# Altium schematic sheet MCU-PWRA.SchDoc
size A3
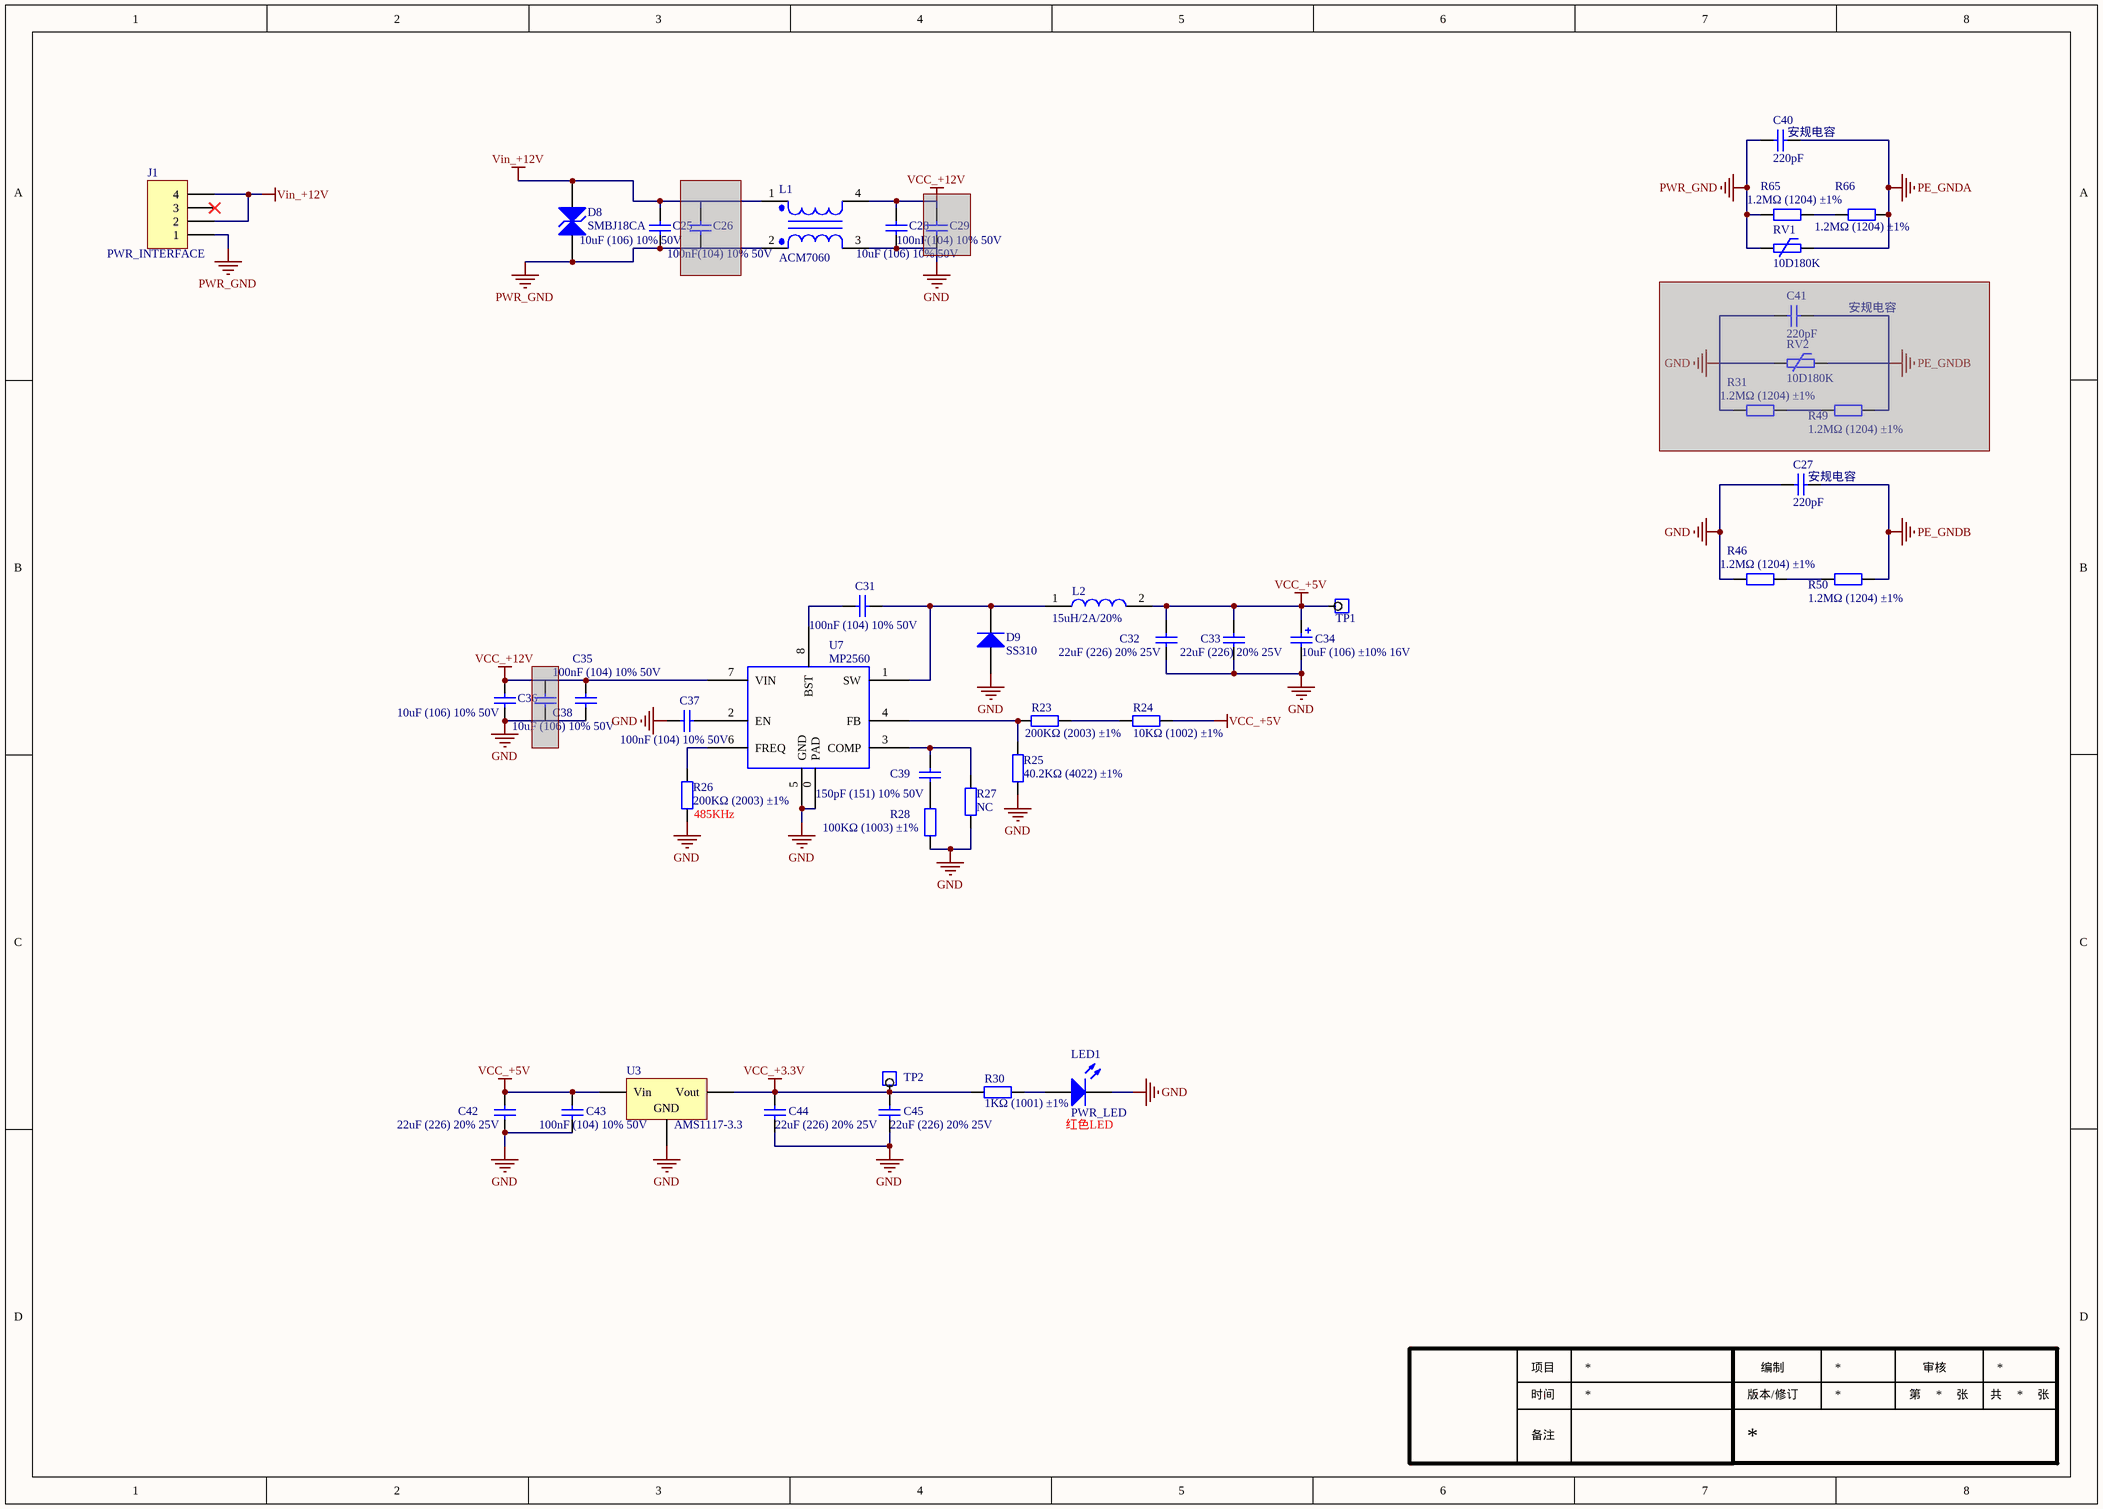
[diagram p0: MCU-PWRA.SchDoc]

## Parts
C25  10uF (106) 10% 50V  [LC-1206_C]
C26  100nF(104) 10% 50V  [LC-0805_C]  (masked out: inside a compile mask, not in the netlist)
C27  220pF  [RCC-DE1B3-ANGUI]
C28  10uF (106) 10% 50V  [LC-1206_C]
C29  100nF(104) 10% 50V  [LC-0805_C]
C31  100nF (104) 10% 50V  [LC-0603_C]
C32  22uF (226) 20% 25V  [LC-0805_C]
C33  22uF (226) 20% 25V  [LC-0805_C]
C34  10uF (106) ±10% 16V  [LC-CASE-A_3216]
C35  100nF (104) 10% 50V  [LC-0603_C]
C36  10uF (106) 10% 50V  [LC-1206_C]
C37  100nF (104) 10% 50V  [LC-0603_C]
C38  10uF (106) 10% 50V  [LC-1206_C]  (masked out: inside a compile mask, not in the netlist)
C39  150pF (151) 10% 50V  [LC-0603_C]
C40  220pF  [RCC-DE1B3-ANGUI]
C41  220pF  [RCC-DE1B3-ANGUI]  (masked out: inside a compile mask, not in the netlist)
C42  22uF (226) 20% 25V  [LC-0805_C]
C43  100nF (104) 10% 50V  [LC-0603_C]
C44  22uF (226) 20% 25V  [LC-0805_C]
C45  22uF (226) 20% 25V  [LC-0805_C]
D8  SMBJ18CA  [RCD-DO-214AAC-D]
D9  SS310  [LC-SMA(DO-214AC)_S1]
J1  PWR_INTERFACE  [RCJ3.96-4CA]
L1  ACM7060  [ACM7060]
L2  15uH/2A/20%  [RCL-040402-2TH]
LED1  PWR_LED  [LC-0603_LED_S1]
R23  200KΩ (2003) ±1%  [LC-0603_R]
R24  10KΩ (1002) ±1%  [LC-0603_R]
R25  40.2KΩ (4022) ±1%  [LC-0603_R]
R26  200KΩ (2003) ±1%  [LC-0603_R]
R27  NC  [LC-0603_R]
R28  100KΩ (1003) ±1%  [LC-0603_R]
R30  1KΩ (1001) ±1%  [LC-0603_R]
R31  1.2MΩ (1204) ±1%  [LC-1206_R]  (masked out: inside a compile mask, not in the netlist)
R46  1.2MΩ (1204) ±1%  [LC-1206_R]
R49  1.2MΩ (1204) ±1%  [LC-1206_R]  (masked out: inside a compile mask, not in the netlist)
R50  1.2MΩ (1204) ±1%  [LC-1206_R]
R65  1.2MΩ (1204) ±1%  [LC-1206_R]
R66  1.2MΩ (1204) ±1%  [LC-1206_R]
RV1  10D180K  [RCRV-10DXXXK]
RV2  10D180K  [RCRV-10DXXXK]  (masked out: inside a compile mask, not in the netlist)
TP1  Test Point  [RCTOOL-TPB]  (value not drawn)
TP2  Test Point  [RCTOOL-TPB]  (value not drawn)
U3  AMS1117-3.3  [LC-SOT-223]
U7  MP2560  [LC-SOIC-8_EP_150mil]

## Nets
GND: C27.1 C28.2 C29.2 C32.1 C33.1 C34.2 C35.1 C36.1 C37.2 C42.1 C43.1 C44.1 C45.1 D9.1(A) L1.3 LED1.K R25.1 R26.1 R27.1 R28.1 R46.1 U3.1(GND) U7.0(PAD) U7.5(GND)
PE_GNDA: C40.1 R66.2 RV1.1
PE_GNDB: C27.2 R50.2
PWR_GND: C25.2 C40.2 D8.1(A) J1.1 L1.2 R65.1 RV1.2
VCC_+3.3V: C44.2 C45.2 R30.1 TP2.1 U3.2(Vout)
VCC_+5V: C32.2 C33.2 C34.1 C42.2 C43.2 L2.2 R24.2 TP1.1 U3.3(Vin)
VCC_+12V: C35.2 C36.2 U7.7(VIN)
Vin_+12V: C25.1 D8.2(K) J1.2 J1.4 L1.1
NetC28_1: C28.1 C29.1 L1.4
NetC31_1: C31.1 D9.2(K) L2.1 U7.1(SW)
NetC31_2: C31.2 U7.8(BST)
NetC37_1: C37.1 U7.2(EN)
NetC39_1: C39.1 R28.2
NetC39_2: C39.2 R27.2 U7.3(COMP)
NetLED1_A: LED1.A R30.2
NetR23_1: R23.1 R25.2 U7.4(FB)
NetR23_2: R23.2 R24.1
NetR26_2: R26.2 U7.6(FREQ)
NetR46_2: R46.2 R50.1
NetR65_2: R65.2 R66.1

Not connected (* = marked no-connect by the designer): J1 3*

## Notes on the sheet
- (near C40) 安规电容
- 安规电容
- (near C27) 安规电容
- (near R26) 485KHz
- (near LED1) 红色LED
- 项目
- 时间
- 版本/修订
- 编制
- 第
- 审核
- 张
- 共
- 备注

## Library data of the parts
C25 C28 C36 C38 = 1206 10uF (106) 10% 50V: 贴片电容; ComponentLink1Description: 供应商链接; ComponentLink1URL: http://www.szlcsc.com/product/details_14236.html; Package: 1206; Supplier: LC; SuppliersPartNumber: C13585
C26 C29 = 0805 100nF(104) 10% 50V: 贴片电容; ComponentLink1Description: 供应商链接; ComponentLink1URL: http://www.szlcsc.com/product/details_50686.html; Package: 0805; Supplier: LC; SuppliersPartNumber: C49678
C27 C41 = Cap_Nonpolar: 无极性电容; Manufacture: Murata; Ordering: DE1B3KX221KN4AP01F; Comments: 220pF; Libnum: *
C31 C35 C37 C43 = 0603 100nF (104) 10% 50V: 贴片电容; ComponentLink1Description: 供应商链接; ComponentLink1URL: http://www.szlcsc.com/product/details_15331.html; Package: 0603; Supplier: LC; SuppliersPartNumber: C14663
C32 C33 C42 C44 C45 = 0805 22uF (226) 20% 25V: 贴片电容; ComponentLink1Description: 供应商链接; ComponentLink1URL: http://www.szlcsc.com/product/details_46786.html; Package: 0805; Supplier: LC; SuppliersPartNumber: C45783
C34 = 3216 10uF (106) 10% 16V: 钽电容; ComponentLink1Description: 供应商链接; ComponentLink1URL: http://www.szlcsc.com/product/details_7643.html; Package: 3216; Supplier: LC; SuppliersPartNumber: C7171
C39 = 0603 150pF (151) 10% 50V: 贴片电容; ComponentLink1Description: 供应商链接; ComponentLink1URL: http://www.szlcsc.com/product/details_1946.html; Package: 0603; Supplier: LC; SuppliersPartNumber: C1594
C40 = Cap_Nonpolar: 无极性电容; Manufacture: Murata; Odering: DE1B3KX221KN4AP01F; Comments: 220pF; Libnum: *
D8 = Bidrectional Diode: Manufacture: VISHAY; Comments: SMBJ18CA; Lib: *; Ordering: SMBJ18CA
D9 = SMA(DO-214AC) SS310: 二极管; ComponentLink1Description: 供应商链接; ComponentLink1URL: http://item.szlcsc.com/16556.html; Package: SMA(DO-214AC); Supplier: LC; SuppliersPartNumber: C15874
J1 = Header 4: Header, 4-Pin; LatestRevisionDate: 17-Jul-2002; LatestRevisionNote: Re-released for DXP Platform.; Publisher: Altium Limited
L1 = ACM7060: 共模滤波器，电源线用，最大电流可达5A; Manufacture: TDK; Ordering: ACM7060-701-2PL-TL01; Comments: ACM7060; Lib: *; LC: http://item.szlcsc.com/79380.html; SuppliersPartNumber: C78246
L2 = Inductor_Single_Lead_Iron: Inductor; Manufacture: 长江微电; Ordering: FNR5040S150MT; Comments: 15uH/2A/20%; LC: http://item.szlcsc.com/179352.html; LC Supplier Part Number: C167969
LED1 = LEDA: Comments: PWR_LED; Libnum: *; Manufacture: *; Odering: *
R23 R26 = 0603 200KΩ (2003) 1%: 贴片电阻; ComponentLink1Description: 供应商链接; ComponentLink1URL: http://www.szlcsc.com/product/details_26554.html; Package: 0603; Supplier: LC; SuppliersPartNumber: C25811
R24 = 0603 10KΩ (1002) 1%: 贴片电阻; ComponentLink1Description: 供应商链接; ComponentLink1URL: http://www.szlcsc.com/product/details_26547.html; Package: 0603; Supplier: LC; SuppliersPartNumber: C25804
R25 = 0603 40.2KΩ (4022) 1%: 贴片电阻; ComponentLink1Description: 供应商链接; ComponentLink1URL: http://www.szlcsc.com/product/details_13081.html; Package: 0603; Supplier: LC; SuppliersPartNumber: C12447
R27 R28 = 0603 100KΩ (1003) 1%: 贴片电阻; ComponentLink1Description: 供应商链接; ComponentLink1URL: http://www.szlcsc.com/product/details_26546.html; Package: 0603; Supplier: LC; SuppliersPartNumber: C25803
R30 = 0603 1KΩ (1001) 1%: 贴片电阻; ComponentLink1Description: 供应商链接; ComponentLink1URL: http://www.szlcsc.com/product/details_21904.html; Package: 0603; Supplier: LC; SuppliersPartNumber: C21190
R31 R46 R49 R50 R65 R66 = 1206 1.2MΩ (1204) 1%: 贴片电阻; ComponentLink1Description: 供应商链接; Package: 1206; Supplier: LC
  R31 R46 R49 R50: ComponentLink1URL: https://item.szlcsc.com/260278.html; SuppliersPartNumber: C270898
  R65 R66: ComponentLink1URL: http://www.szlcsc.com/product/details_22832.html; SuppliersPartNumber: C22107
RV1 RV2 = RV: 压敏电阻 浪涌抑制; Manufacture: RUILON; Comments: 10D180K; Libnum: *; Ordering: 10D180K
TP1 TP2 = TP Point
U3 = SOT-223 AMS1117-3.3: 低压差线性稳压(LDO); ComponentLink1Description: 供应商链接; ComponentLink1URL: http://www.szlcsc.com/product/details_6652.html; Package: SOT-223; Supplier: LC; SuppliersPartNumber: C6186
U7 = MP2560: DC~DC Step Down; Manufacture: MPS; Ordering: MP2560DN; Comments: MP2560; Lib: *; LC: https://item.szlcsc.com/39866.html; SuppliersPartNumber: C38883